# EAGLE design node (EAGLE 9.6.2)

## Sheet 1 of 2
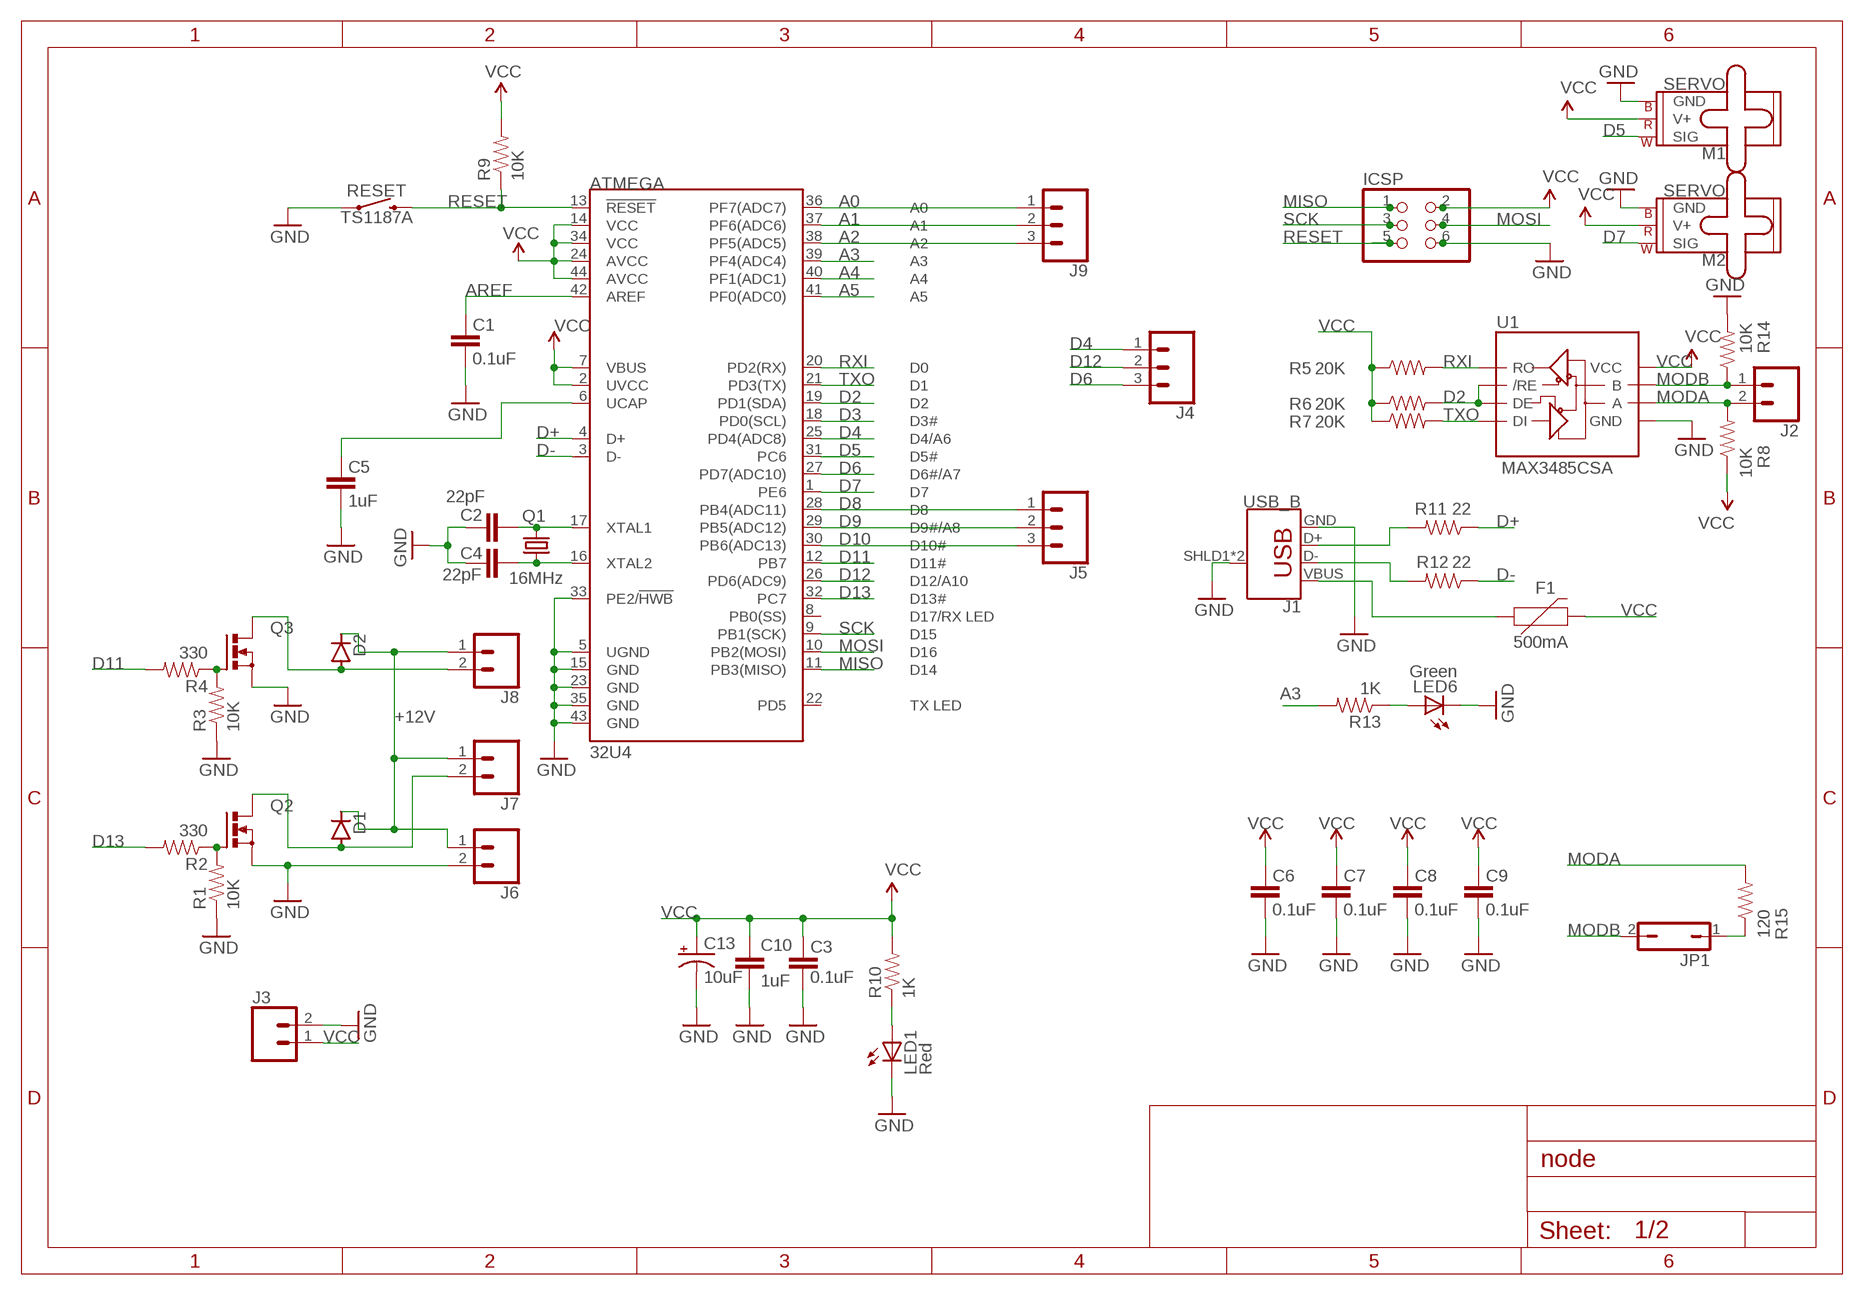
[diagram p0: schematic, sheet 1]

### Parts
ATMEGA  32U4  ATMEGA32U41:1  [QFN-44-NOPAD_1:1]
C1  0.1uF  CAP0603-CAP  [0603-CAP]
C2  22pF  CAP0603-CAP  [0603-CAP]
C3  0.1uF  CAP0603-CAP  [0603-CAP]
C4  22pF  CAP0603-CAP  [0603-CAP]
C5  1uF  CAP0603-CAP  [0603-CAP]
C6  0.1uF  CAP0603-CAP  [0603-CAP]
C7  0.1uF  CAP0603-CAP  [0603-CAP]
C8  0.1uF  CAP0603-CAP  [0603-CAP]
C9  0.1uF  CAP0603-CAP  [0603-CAP]
C10  1uF  CAP0603-CAP  [0603-CAP]
C13  10uF  CAP_POL1206  [EIA3216]
D1  BYS10  [SOD106A]
D2  BYS10  [SOD106A]
F1  500mA  PPTC_HALF-AMP  [1206]
ICSP  PINHD-2X3  [2X03]
J1  USB_B  USB_B_PTH  [USB-B-PTH]
J2  CONN_025MM  [SCREWTERMINAL-5MM-2]
J3  CONN_025MM  [SCREWTERMINAL-5MM-2]
J4  CONN_03-SCREW-5MM  [SCREWTERMINAL-5MM-3]
J5  CONN_03-SCREW-5MM  [SCREWTERMINAL-5MM-3]
J6  CONN_025MM  [SCREWTERMINAL-5MM-2]
J7  CONN_025MM  [SCREWTERMINAL-5MM-2]
J8  CONN_025MM  [SCREWTERMINAL-5MM-2]
J9  CONN_03-SCREW-5MM  [SCREWTERMINAL-5MM-3]
JP1  JP1Q  [JP1]
LED1  Red  LED0603  [LED-0603]
LED6  Green  LED0603  [LED-0603]
M1  SERVO  [1X03]
M2  SERVO  [1X03]
Q1  16MHz  KX-7  [3.2X2.5_KX-7]
Q2  PMOSFET_NTO220BV  [TO220BV]
Q3  PMOSFET_NTO220BV  [TO220BV]
R1  10K  RESISTOR0603-RES  [0603-RES]
R2  330  RESISTOR0603-RES  [0603-RES]
R3  10K  RESISTOR0603-RES  [0603-RES]
R4  330  RESISTOR0603-RES  [0603-RES]
R5  20K  RESISTOR0603-RES  [0603-RES]
R6  20K  RESISTOR0603-RES  [0603-RES]
R7  20K  RESISTOR0603-RES  [0603-RES]
R8  10K  RESISTOR0603-RES  [0603-RES]
R9  10K  RESISTOR0603-RES  [0603-RES]
R10  1K  RESISTOR0603-RES  [0603-RES]
R11  22  RESISTOR0603-RES  [0603-RES]
R12  22  RESISTOR0603-RES  [0603-RES]
R13  1K  RESISTOR0603-RES  [0603-RES]
R14  10K  RESISTOR0603-RES  [0603-RES]
R15  120  RESISTOR0603-RES  [0603-RES]
RESET  TS1187A  MOMENTARY-SWITCH-SPST-SMD-5.2MM  [TACTILE_SWITCH_SMD_5.2MM]
U1  MAX3485CSA  RS485SOIC  [SO08]

### Nets
+12V: D1.K D2.K J6.1 J7.1 J8.1
A0: ATMEGA.36(PF7(ADC7)) J9.1
A1: ATMEGA.37(PF6(ADC6)) J9.2
A2: ATMEGA.38(PF5(ADC5)) J9.3
A3: ATMEGA.39(PF4(ADC4)) R13.2
A4: ATMEGA.40(PF1(ADC1))
A5: ATMEGA.41(PF0(ADC0))
AREF: ATMEGA.42(AREF) C1.2
D2: ATMEGA.19(PD1(SDA)) R6.2 U1.2(/RE) U1.3(DE)
D3: ATMEGA.18(PD0(SCL))
D4: ATMEGA.25(PD4(ADC8)) J4.1
D5: ATMEGA.31(PC6) M1.1(SIG)
D6: ATMEGA.27(PD7(ADC10)) J4.3
D7: ATMEGA.1(PE6) M2.1(SIG)
D8: ATMEGA.28(PB4(ADC11)) J5.1
D9: ATMEGA.29(PB5(ADC12)) J5.2
D10: ATMEGA.30(PB6(ADC13)) J5.3
D11: ATMEGA.12(PB7) R4.2
D12: ATMEGA.26(PD6(ADC9)) J4.2
D13: ATMEGA.32(PC7) R2.2
D+: ATMEGA.4(D+) R11.1
D-: ATMEGA.3(D-) R12.1
GND [vcc]: ATMEGA.5(UGND) ATMEGA.15(GND) ATMEGA.23(GND) ATMEGA.33(PE2/!HWB) ATMEGA.35(GND) ATMEGA.43(GND) C1.1 C2.2 C3.1 C4.2 C5.1 C6.1 C7.1 C8.1 C9.1 C10.2 C13.C(-) ICSP.6 J1.GND J1.SHLD1(SHIELD) J1.SHLD2(SHIELD) J3.2 J6.2 LED1.C LED6.C M1.3(GND) M2.3(GND) Q2.S Q3.S R1.1 R3.1 R14.2 RESET.1 U1.5(GND)
MISO: ATMEGA.11(PB3(MISO)) ICSP.1
MODA: J2.2 R8.2 R15.2 U1.6(A)
MODB: J2.1 JP1.2 R14.1 U1.7(B)
MOSI: ATMEGA.10(PB2(MOSI)) ICSP.4
N$1: ATMEGA.16(XTAL2) C4.1 Q1.1
N$2: ATMEGA.17(XTAL1) C2.1 Q1.3
N$3: JP1.1 R15.1
N$4: ATMEGA.6(UCAP) C5.2
N$6: J1.D- R12.2
N$7: Q2.G R1.2 R2.1
N$8: J1.D+ R11.2
N$11: D1.A J7.2 Q2.D
N$13: Q3.G R3.2 R4.1
N$16: D2.A J8.2 Q3.D
N$21: LED6.A R13.1
N$26: F1.1 J1.VBUS
N$38: LED1.A R10.1
RESET: ATMEGA.13(!RESET) ICSP.5 R9.1 RESET.3
RXI: ATMEGA.20(PD2(RX)) R5.2 U1.1(RO)
SCK: ATMEGA.9(PB1(SCK)) ICSP.3
TXO: ATMEGA.21(PD3(TX)) R7.2 U1.4(DI)
VCC: ATMEGA.2(UVCC) ATMEGA.7(VBUS) ATMEGA.14(VCC) ATMEGA.24(AVCC) ATMEGA.34(VCC) ATMEGA.44(AVCC) C3.2 C6.2 C7.2 C8.2 C9.2 C10.1 C13.A(+) F1.2 ICSP.2 J3.1 M1.2(V+) M2.2(V+) R5.1 R6.1 R7.1 R8.1 R9.2 R10.2 U1.8(VCC) ; supply symbol labelled UVCC
Unconnected: ATMEGA.8(PB0(SS)) ATMEGA.22(PD5)

## Sheet 2 of 2
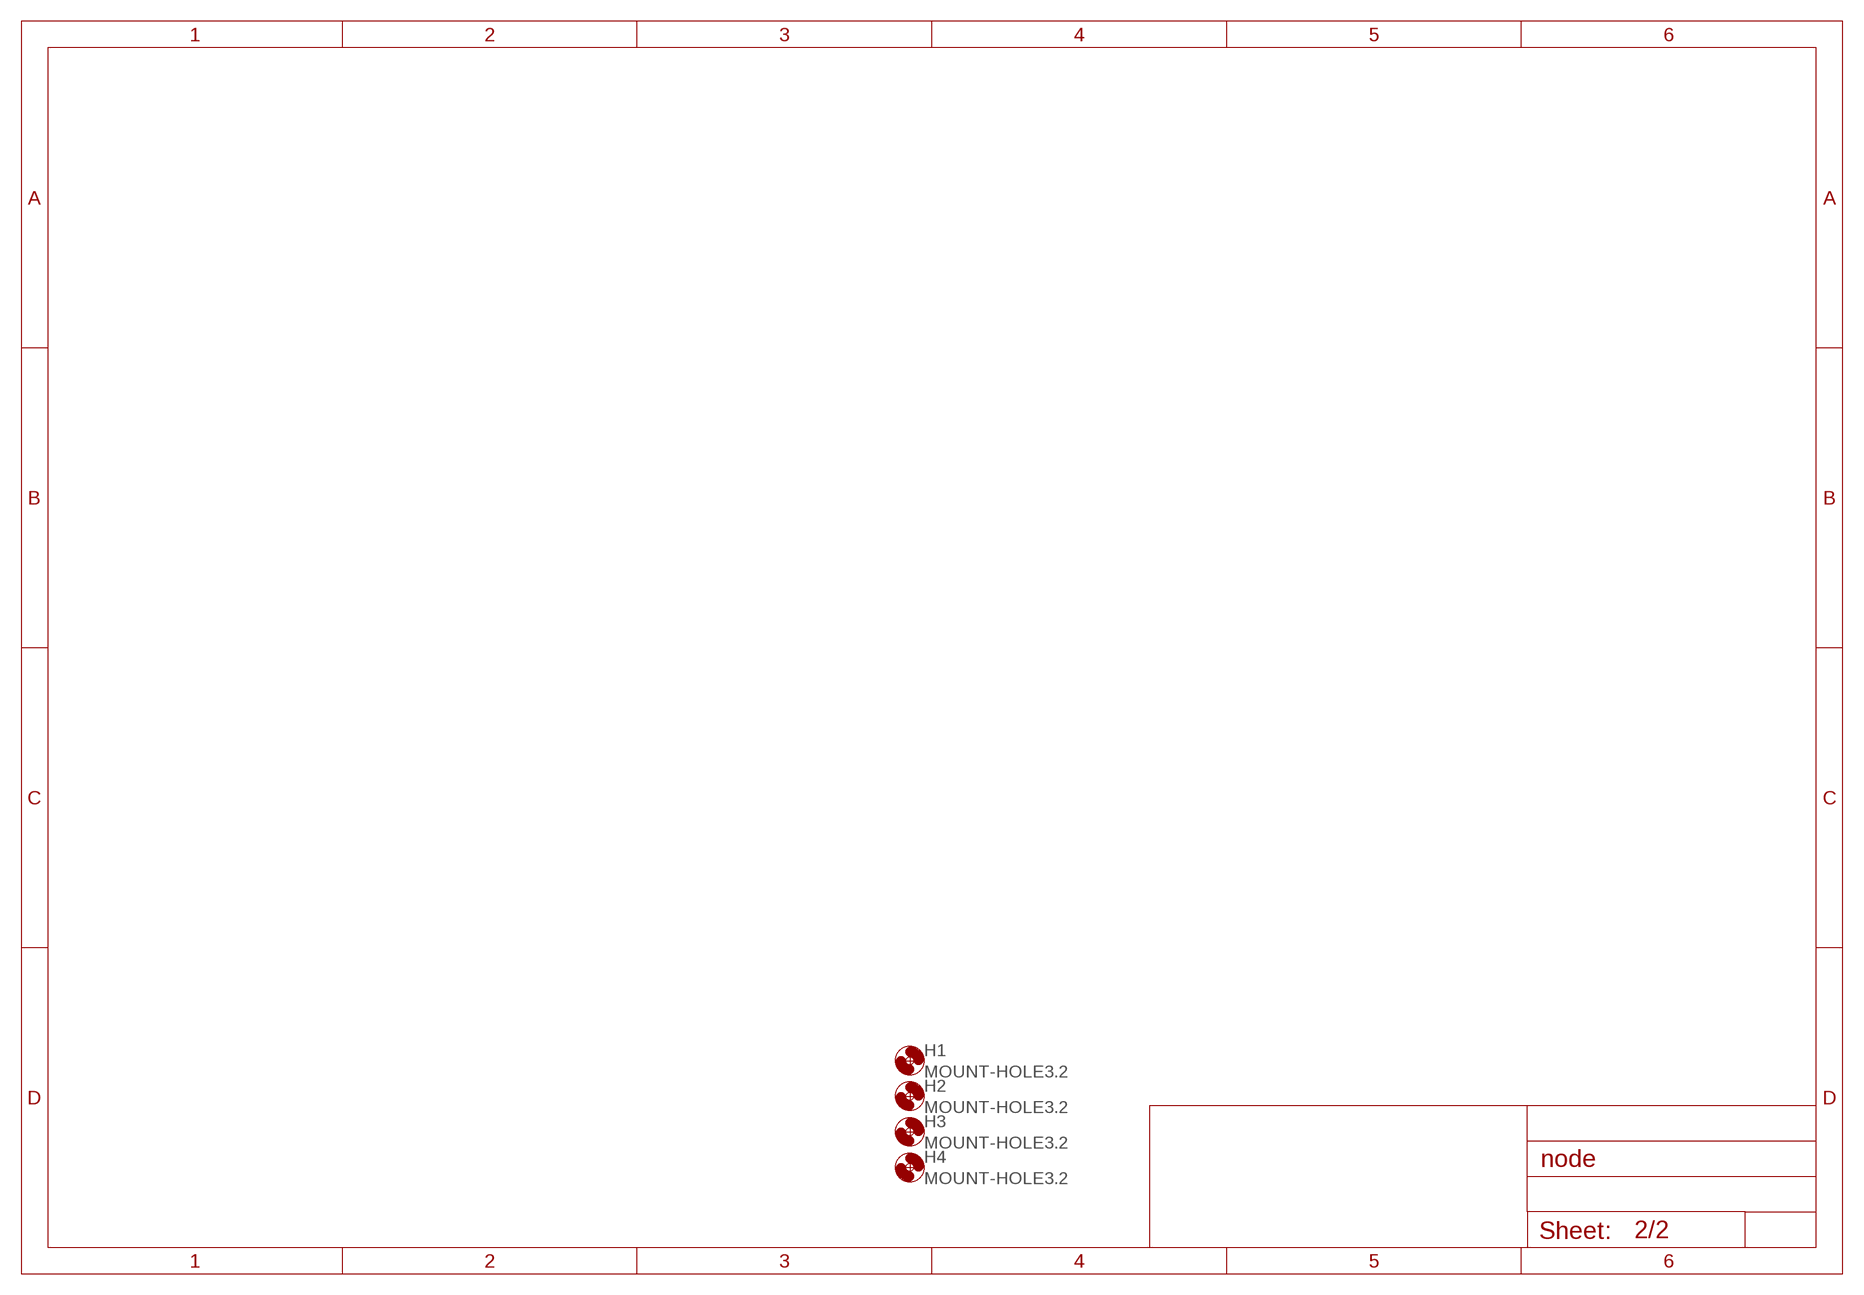
[diagram p1: schematic, sheet 2]

### Parts
H1  MOUNT-HOLE3.2  [3,2]
H2  MOUNT-HOLE3.2  [3,2]
H3  MOUNT-HOLE3.2  [3,2]
H4  MOUNT-HOLE3.2  [3,2]

## Library data of the parts
ATMEGA = SparkFun-IC-Microcontroller:ATMEGA32U4: Atmel MCU, 32KByte Atmel 44-pin 8-bit Microcontroller with 32KBytes of ISP Flash and USB Controller Datasheet <http://cdn.sparkfun.com/datasheets/Dev/Arduino/Boards/ATMega32U4.pdf> SparkFun Products LilyPad Arduino USB - ATmega32U4 Board <https://www.sparkfun.com/products/12049> (DEV-12049) Pro Micro - 5V/16MHz <https://www.sparkfun.com/products/12640> (DEV-12640) Pro Micro - 3.3V/8MHz <https://www.sparkfun.com/products/12587> (DEV-12587) Fio v3 - ATmega32U4 <https://www.sparkfun.com/products/11520> (DEV-11520) Qduino Mini <https://www.sparkfun.com/products/13614> (DEV-13614) Makey Makey - Standard Kit <https://www.sparkfun.com/products/11511> (WIG-11511) Makey Makey Deluxe Kit <https://www.sparkfun.com/products/11519> (WIG-11519); PROD_ID: IC-10828
C1-C10 = SparkFun:CAP: Capacitor Standard 0603 ceramic capacitor, and 0.1" leaded capacitor.
C13 = SparkFun:CAP_POL: Capacitor Polarized These are standard SMD and PTH capacitors. Normally 10uF, 47uF, and 100uF in electrolytic and tantalum varieties. Always verify the external diameter of the through hole cap, it varies with capacity, voltage, and manufacturer. The EIA devices should be standard.
D1 D2 = telefunken:BYS10: DIODE; MPN: BYS10/45; OC_FARNELL: 9549188; OC_NEWARK: 96K7236
F1 = SparkFun-Fuses:PPTC: Resettable Fuse PPTC Resettable Fuse. Really a sort of resistor with a polymeric positive temperature coefficient whose resistance increases dramatically with an increase in temperature. When heated by the power passing through the resistance rises causing the current to be limited, protecting the circuit. This is achieved by the transition of the polymer from a crystalline to an amorphous state where the conductive carbon separates breaking the conductive pathways found in the cool crystalline structure. When a PPTC cools back down it resumes conducting letting the circuit turn back on. SparkFun Products: SparkFun RedBoard - Programmed with Arduino <https://www.sparkfun.com/products/12757> Pro Micro - 5V/16MHz <https://www.sparkfun.com/products/12640> Arduino Pro 328 - 5V/16MHz <https://www.sparkfun.com/products/10915> MP3 Trigger <https://www.sparkfun.com/products/13720>; PROD_ID: RES-08585; VALUE: 6V/0.5A
H1-H4 = holes:MOUNT-HOLE: MOUNTING HOLE with drill center marker
ICSP = pinhead:PINHD-2X3: PIN HEADER
J1 = SparkFun-Connectors:USB_B: USB Type B Connector SparkFun Products: SparkFun Stepoko <https://www.sparkfun.com/products/13899> PTH; PROD_ID: CONN-08278; SF_ID: PRT-00139
J2 J3 J6-J8 = SparkFun-Connectors:CONN_02: Multi connection point. Often used as Generic Header-pin footprint for 0.1 inch spaced/style header connections On any of the 0.1 inch spaced packages, you can populate with these: Break Away Headers - Straight <https://www.sparkfun.com/products/116> (PRT-00116) Break Away Male Headers - Right Angle <https://www.sparkfun.com/products/553> (PRT-00553) Female Headers <https://www.sparkfun.com/products/115> (PRT-00115) Break Away Headers - Machine Pin <https://www.sparkfun.com/products/117> (PRT-00117) Break Away Female Headers - Swiss Machine Pin <https://www.sparkfun.com/products/743> (PRT-00743) For SCREWTERMINALS and SPRING TERMINALS visit here: Screw Terimnals on SparkFun.com <https://www.sparkfun.com/search/results?term=Screw+Terminals> (5mm/3.5mm/2.54mm spacing) This device is also useful as a general connection point to wire up your design to another part of your project. Our various solder wires solder well into these plated through hole pads. Hook-Up Wire - Assortment (Stranded, 22 AWG) <https://www.sparkfun.com/products/11375> (PRT-11375) Hook-Up Wire - Assortment (Solid Core, 22 AWG) <https://www.sparkfun.com/products/11367> (PRT-11367) View the entire wire category on our website here <https://www.sparkfun.com/categories/141> Special notes: Molex polarized connector foot print use with: PRT-08233 with associated crimp pins and housings. 2.54_SCREWTERM for use with PRT-10571. 3.5mm Screw Terminal footprints for PRT-08084 5mm Screw Terminal footprints for use with PRT-08432; SF_SKU: PRT-08432
J4 J5 J9 = SparkFun-Connectors:CONN_03: Multi connection point. Often used as Generic Header-pin footprint for 0.1 inch spaced/style header connections On any of the 0.1 inch spaced packages, you can populate with these: Break Away Headers - Straight <https://www.sparkfun.com/products/116> (PRT-00116) Break Away Male Headers - Right Angle <https://www.sparkfun.com/products/553> (PRT-00553) Female Headers <https://www.sparkfun.com/products/115> (PRT-00115) Break Away Headers - Machine Pin <https://www.sparkfun.com/products/117> (PRT-00117) Break Away Female Headers - Swiss Machine Pin <https://www.sparkfun.com/products/743> (PRT-00743) Stackable Header - 3 Pin (Female, 0.1") <https://www.sparkfun.com/products/13875> (PRT-13875) For SCREWTERMINALS and SPRING TERMINALS visit here: Screw Terimnals on SparkFun.com <https://www.sparkfun.com/search/results?term=Screw+Terminals> (5mm/3.5mm/2.54mm spacing) This device is also useful as a general connection point to wire up your design to another part of your project. Our various solder wires solder well into these plated through hole pads. Hook-Up Wire - Assortment (Stranded, 22 AWG) <https://www.sparkfun.com/products/11375> (PRT-11375) Hook-Up Wire - Assortment (Solid Core, 22 AWG) <https://www.sparkfun.com/products/11367> (PRT-11367) View the entire wire category on our website here <https://www.sparkfun.com/categories/141> Special notes: Molex polarized connector foot print use with SKU : PRT-08232 with associated crimp pins and housings.; PROD_ID: CONN-10134; SF_SKU: PRT-08433
JP1 = jumper:JP1Q: JUMPER
LED1 LED6 = SparkFun:LED: LEDs Standard schematic elements and footprints for 5mm, 3mm, 1206, and 0603 sized LEDs. 5mm - Spark Fun Electronics SKU : COM-00529 (and others)
M1 M2 = SparkFun-Electromechanical:SERVO: Servo Motor 3-pin connector for a standard servo motor (voltage supply, ground, and control signal.) SparkFun Products Servo - Generic (Sub-Micro Size) <https://www.sparkfun.com/products/9065> (ROB-09065) Servo - Generic High Torque Continuous Rotation (Standard Size) <https://www.sparkfun.com/products/9347> (ROB-09347) Servo - Generic High Torque (Standard Size) <https://www.sparkfun.com/products/11965> (ROB-11965)
Q1 = crystal-geyer_V1_0:KX: Quartz Crystals (MHz) SMD: KX - Serie Model Size l/w/h [mm] Frequency Range Frequency Stability Temp. Range [°C] Load Capacitance AECQ 200 availabel Datasheet KX-4 KX-5 KX-6 KX-7 KX-9A KX-9B KX-12A KX-12B KX-13 KX-20 KX-K KX-KS 1.6/1.2/0.3 2.0/1.6/0.45 2.5/2.0/0.55 3.2/2.5/0.8 5.0/3.2/1.0 5.0/3.2/1.1 6.0/3.5/1.1 6.0/3.5/1.0 7.0/5.0 /1.3 11.6/5.5/1.6 12.3/4.5/4.2 12.3/4.5/3.2 24.0 ~ 80.0 MHz 16.0 ~ 80.0 MHz 12.0 ~ 80.0 MHz 8.0 ~ 60.0 MHz 7,68 ~ 300,0 MHz 8,0 ~ 50,0 MHz 8,0 ~ 150,0 MHz 8,0 ~ 50,0 MHz 6,0 ~ 160,0 MHz 3,579 ~ 25,0 MHz 3,579 ~ 70,0 MHz 3,579 ~ 70,0 MHz ±10 … ±50ppm ±10 … ±50ppm ±10 … ±50ppm ±10 … ±50ppm ±10 … ±50ppm ±10 … ±50ppm ±10 … ±50ppm ±10 … ±50ppm ±10 … ±50ppm ±50ppm ±10 … ±50ppm ±10 … ±50ppm (*) -40°C …+85°C (*) -40°C …+125°C (*) -40°C …+125°C (*) -40°C …+125°C (*) -40°C …+105°C (*) -40°C …+105°C (*) -40°C …+125°C (*) -40°C …+105°C (*) -40°C …+105°C (*) -40°C …+105°C (*) -40°C …+85°C (*) -40°C …+85°C 8, 8…16 8, 8…16 10, 8…16 12, 7…20 16, 10…20 16, 10…20 16, 10…20 16, 12…20 16, 12…20 16, 12…20 16, 12…30 16, 12…30 - yes yes yes - - - - - - - - KX-4.pdf <http://www.geyer-electronic.de/uploads/tx_userartikelfrequenz/GEYER-KX-4.pdf> KX-5.pdf <http://www.geyer-electronic.de/uploads/tx_userartikelfrequenz/GEYER-KX-5.pdf> KX-6.pdf <http://www.geyer-electronic.de/uploads/tx_userartikelfrequenz/GEYER-KX-6.pdf> KX-7.pdf <http://www.geyer-electronic.de/uploads/tx_userartikelfrequenz/GEYER-KX-7.pdf> KX-9A.pdf <http://www.geyer-electronic.de/uploads/tx_userartikelfrequenz/GEYER-KX-9A.pdf> KX-9B.pdf <http://www.geyer-electronic.de/uploads/tx_userartikelfrequenz/GEYER-KX-9B.pdf> KX-12A.pdf <http://www.geyer-electronic.de/uploads/tx_userartikelfrequenz/GEYER-KX-12A.pdf> KX-12B.pdf <http://www.geyer-electronic.de/uploads/tx_userartikelfrequenz/GEYER-KX-12B.pdf> KX-13.pdf <http://www.geyer-electronic.de/uploads/tx_userartikelfrequenz/GEYER-KX-13.pdf> KX-20.pdf <http://www.geyer-electronic.de/uploads/tx_userartikelfrequenz/GEYER-KX-20.pdf> KX-K.pdf <http://www.geyer-electronic.de/uploads/tx_userartikelfrequenz/GEYER-KX-K.pdf> KX-KS.pdf <http://www.geyer-electronic.de/uploads/tx_userartikelfrequenz/GEYER-KX-KS.pdf> <http://www.geyer-electronic.de/fileadmin/template/img/logo-geyer-electronic.png> Details see: http://www.geyer-electronic.de/Frequenz-Produkte.9.0.html Created 2016-06-07, Hans Locher 2016 (C) Geyer Quartz Technology KX4,KX5,KX6,KX7,KX9A,KX9B,KX12A,KX12B,KX13,KX20,KXK,KXKS;1612;2016;2520;3225;5032;6035;7050;11655;12345;1,6x1,2;2,0x1,6;2,5x2,0;3,2x2,5;5,0x3,2;6,0x3,5;7,0x5,0;11,6x5,5;12,3x4,5;12,3x4,5;1.6x1.2;2.0x1.6;2.5x2.0;3.2x2.5;5.0x3.2;6.0x3.5;7.0x5.0;11.6x5.5;12.3x4.5;12.3x4.5;
Q2 Q3 = transistor-power:PMOSFET_N: Power MOSFET N-Channel
R1-R15 = SparkFun:RESISTOR: Resistor Basic schematic elements and footprints for 0603, 1206, and PTH resistors.
RESET = SparkFun-Switches:MOMENTARY-SWITCH-SPST: Momentary Switch (Pushbutton) - SPST Normally-open (NO) SPST momentary switches (buttons, pushbuttons). Variants PTH-12MM - 12mm square, through-hole Momentary Pushbutton Switch - 12mm Square <https://www.sparkfun.com/products/9190> (COM-09190) PTH-6.0MM, PTH-6.0MM-KIT - 6.0mm square, through-hole Mini Pushbutton Switch <https://www.sparkfun.com/products/97> (COM-00097) KIT package intended for soldering kit's - only one side of pads' copper is exposed. PTH-RIGHT-ANGLE-KIT - Right-angle, through-hole Right Angle Tactile Button <https://www.sparkfun.com/products/10791> - Used on SparkFun BigTime Watch Kit <https://www.sparkfun.com/products/11734> SMD-12MM - 12mm square, surface-mount Tactile Button - SMD (12mm) <https://www.sparkfun.com/products/12993> (COM-12993) Used on SparkFun PicoBoard <https://www.sparkfun.com/products/11888> SMD-4.5MM - 4.5mm Square Trackball Switch Used on SparkFun Blackberry Trackballer Breakout <https://www.sparkfun.com/products/13169> SMD-4.6MMX2.8MM - 4.60mm x 2.80mm, surface mount Used on SparkFun SAMD21 Mini Breakout <https://www.sparkfun.com/products/13664> SMD-5.2MM, SMD-5.2-REDUNDANT - 5.2mm square, surface-mount Mini Pushbutton Switch - SMD <https://www.sparkfun.com/products/8720> (COM-08720) Used on Arduino Pro Mini <https://www.sparkfun.com/products/11114> REDUNDANT package connects both switch circuits together SMD-6.0X3.5MM - 6.0 x 3.5mm, surface mount Momentary Reset Switch SMD <https://www.sparkfun.com/products/8229> (COM-08229) SMD-6.2MM-TALL - 6.2mm square, surface mount Tactile Button - SMD (6mm) <https://www.sparkfun.com/products/12992> Used on SparkFun Digital Sandbox <https://www.sparkfun.com/products/12651> SMD-RIGHT-ANGLE - Right-angle, surface mount Used on SparkFun Block for Intel® Edison - Arduino <https://www.sparkfun.com/products/13036>; PROD_ID: SWCH-08247; SF_SKU: COM-08720
U1 = SparkFun-IC-Comms:RS485: RS-485 Transceiver SP3485 Series 8 Pin NSOIC 3.3 V Low Power Half Duplex RS-485 Transceiver MAX3485 compatible Datasheet <http://www.sparkfun.com/datasheets/Components/General/sp3485CN-LTR.pdf> SparkFun Products SparkFun Transceiver Breakout - RS-485 <https://www.sparkfun.com/products/10124> (BOB-10124) SparkFun USB to RS-485 Converter <https://www.sparkfun.com/products/9822> (BOB-09822); PROD_ID: IC-09388

## Net classes
0 default: width 0.203 mm

## Board
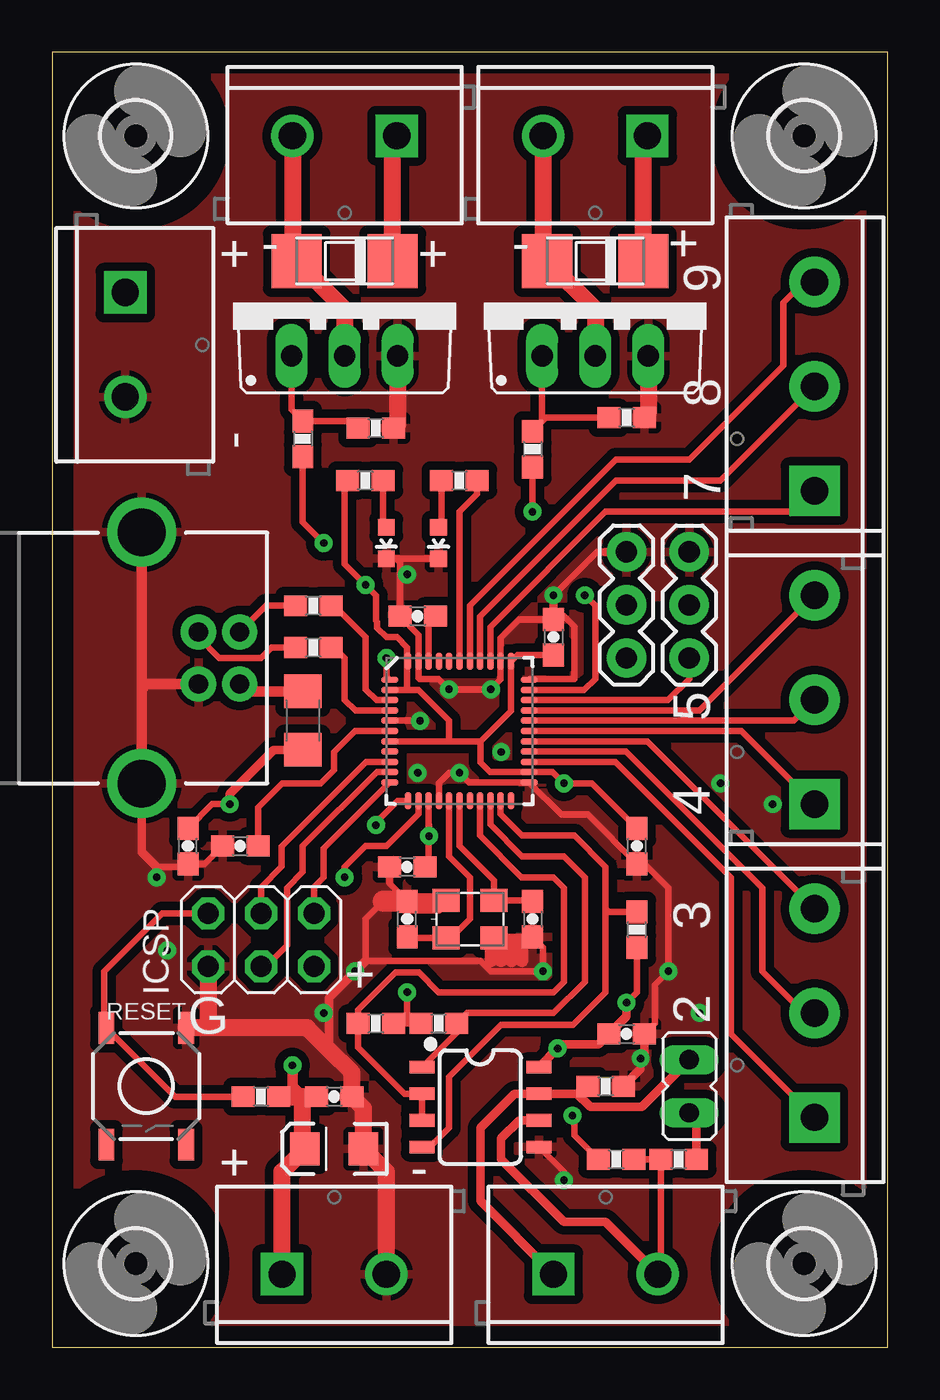
[diagram p2: board, top side]
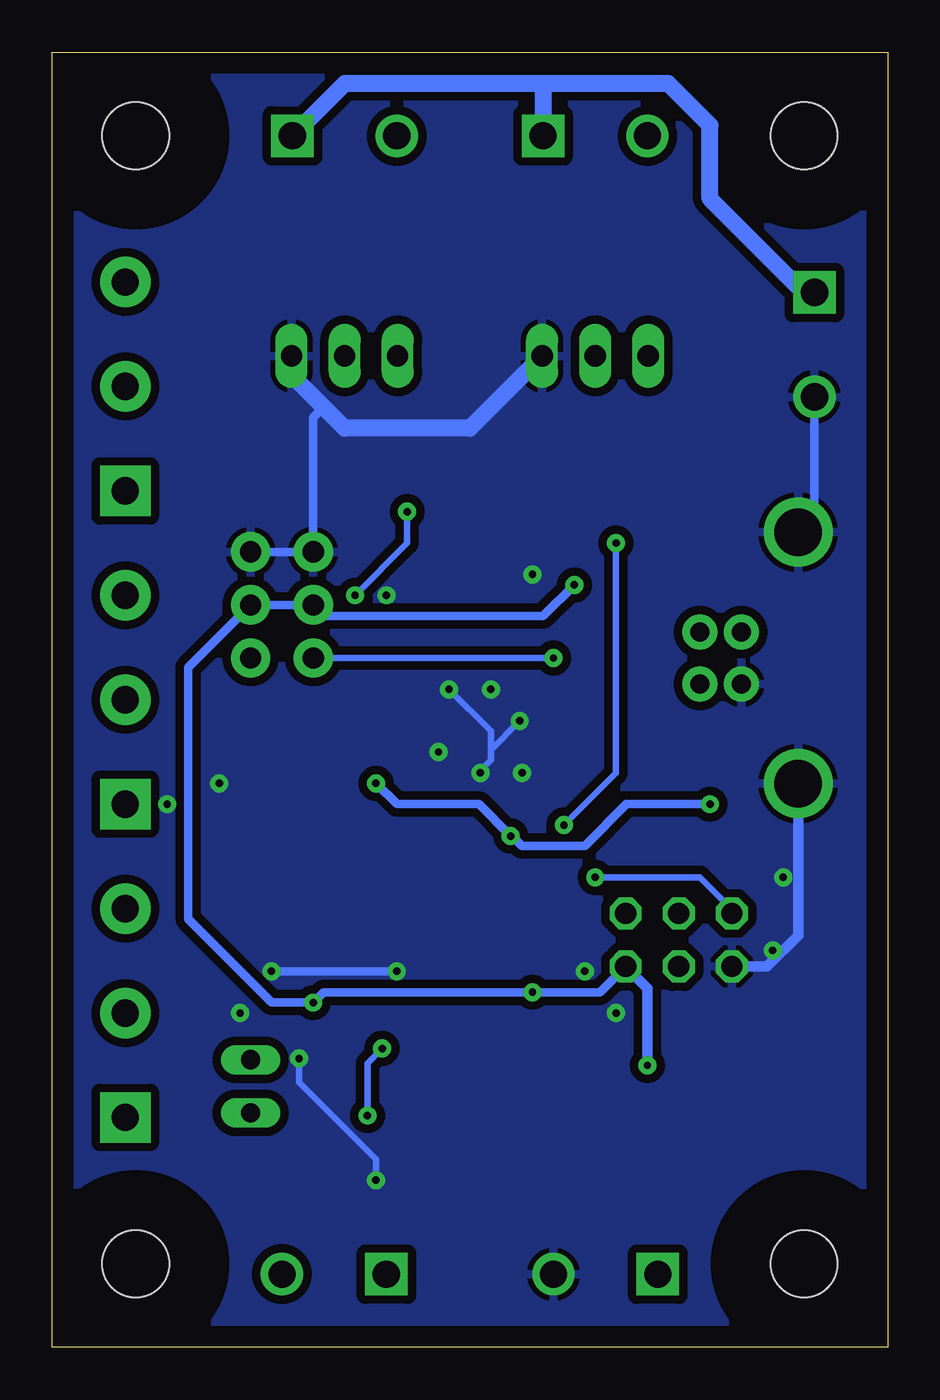
[diagram p3: board, bottom side, seen from below]

Size 40 x 62 mm. Coordinates in mm from the lower left corner, seen from the top.
Outline: 0,0 40,0 40,62 0,62 0,0
Copper layers (1*16): Top 0.035mm / dielectric 1.5mm / Bottom 0.035mm
Design rules "default *": minimum track width 12mil, minimum drill 0.35mm, track to track 6mil, track to pad 6mil, pad to pad 6mil, via to via 6mil, smd to smd 6mil, copper to edge 40mil, drill to drill 12mil, minimum pad ring 10mil, minimum via ring 10mil, stop-mask expansion 4mil, vias tented up to drill 100mil, thermal gap 10mil

### Footprints (pad centres in the part's own frame; a part is rotated, then mirrored left to right if it is on the bottom)
QFN-44-NOPAD_1:1 = smd 0.8 x 0.3: 1 -3.337,2.458; 2 -3.337,1.958; 3 -3.337,1.479; 4 -3.337,0.979; 5 -3.337,0.5; 6 -3.337,0; 7 -3.337,-0.5; 8 -3.337,-0.979; 9 -3.337,-1.479; 10 -3.337,-1.958; 11 -3.337,-2.458; 23 3.337,-2.458; 24 3.337,-1.958; 25 3.337,-1.479; 26 3.337,-0.979; 27 3.337,-0.5; 28 3.337,0; 29 3.337,0.5; 30 3.337,0.979; 31 3.337,1.479; 32 3.337,1.958; 33 3.337,2.458 | smd 0.3 x 0.8: 12 -2.458,-3.337; 13 -1.958,-3.337; 14 -1.479,-3.337; 15 -0.979,-3.337; 16 -0.5,-3.337; 17 0,-3.337; 18 0.5,-3.337; 19 0.979,-3.337; 20 1.479,-3.337; 21 1.958,-3.337; 22 2.458,-3.337; 34 2.458,3.337; 35 1.958,3.337; 36 1.479,3.337; 37 0.979,3.337; 38 0.5,3.337; 39 0,3.337; 40 -0.5,3.337; 41 -0.979,3.337; 42 -1.479,3.337; 43 -1.958,3.337; 44 -2.458,3.337
0603-CAP = smd 1.1 x 1: 1 -0.85,0; 2 0.85,0
EIA3216 = smd 1.4 x 1.6: A 1.4,0; C -1.4,0
SOD106A = smd 2.4 x 2.6: A 2.3,0; K -2.3,0
1206 = smd 1.6 x 1.8: 1 -1.4,0; 2 1.4,0
3,2 = hole 3.2: 0,0
2X03 = drill 1.016 octagon: 1 -2.54,-1.27; 2 -2.54,1.27; 3 0,-1.27; 4 0,1.27; 5 2.54,-1.27; 6 2.54,1.27
USB-B-PTH = drill 0.914 pad 1.676: D+ 4,1.25; D- 5.981,1.25; GND 4,-1.25; VBUS 5.981,-1.25 | drill 2.286: SHLD1 1.282,-6.02; SHLD2 1.282,6.02
SCREWTERMINAL-5MM-2 = drill 1.3 pad 2.032 square: 1 0,0 | drill 1.3 pad 2.032: 2 5,0
SCREWTERMINAL-5MM-3 = drill 1.3 pad 2.413 square: 1 0,0 | drill 1.3 pad 2.413: 2 5,0; 3 10,0
JP1 = drill 0.914 long: 1 0,-1.27; 2 0,1.27
LED-0603 = smd 0.8 x 0.8: A 0,-0.75; C 0,0.75
1X03 = drill 1.016 pad 1.88: 1 0,0; 2 2.54,0; 3 5.08,0
3.2X2.5_KX-7 = smd 1.3 x 1.1: 1 -1.15,-0.9; 2 1.15,-0.9; 3 1.15,0.9; 4 -1.15,0.9
TO220BV = drill 1.016 long: D 0,-2.54; G -2.54,-2.54; S 2.54,-2.54
0603-RES = smd 1.1 x 1: 1 -0.85,0; 2 0.85,0
TACTILE_SWITCH_SMD_5.2MM = smd 1.524 x 0.762: 1 -2.794,1.905; 2 2.794,1.905; 3 -2.794,-1.905; 4 2.794,-1.905
SO08 = smd 0.6 x 1.2: 1 -1.905,-2.8; 2 -0.635,-2.8; 3 0.635,-2.8; 4 1.905,-2.8; 5 1.905,2.8; 6 0.635,2.8; 7 -0.635,2.8; 8 -1.905,2.8

### Placement (x,y rotation side)
ATMEGA  19.5,29.5 0 top
C1  17.5,35 0 top
C2  23,20.5 270 top
C3  13.5,12 180 top
C4  17,20.5 90 top
C5  9,24 0 top
C6  28,24 90 top
C7  24,34 270 top
C8  6.5,24 90 top
C9  17,23 0 top
C10  27.5,15 0 top
C13  13.5,9.5 180 top
D1  26,52 180 top
D2  14,52 180 top
F1  12,30 270 top
H1  4,4 0 top
H2  36,58 0 top
H3  36,4 0 top
H4  4,58 0 top
ICSP  10,19.5 180 top
J1  3,33 0 top
J2  24,3.5 0 top
J3  11,3.5 0 top
J4  36.5,11 90 top
J5  36.5,26 90 top
J6  3.5,50.5 270 top
J7  28.5,58 180 top
J8  16.5,58 180 top
J9  36.5,41 90 top
JP1  30.5,12.5 0 top
LED1  16,38.5 180 top
LED6  18.5,38.5 180 top
M1  30.5,33 90 top
M2  27.5,33 90 top
Q1  20,20.5 0 top
Q2  26,50 0 top
Q3  14,50 0 top
R1  27.5,44.5 180 top
R2  23,43 270 top
R3  15.5,44 180 top
R4  12,43.5 270 top
R5  18.5,15.5 0 top
R6  15.5,15.5 180 top
R7  28,20 90 top
R8  27,9 0 top
R9  10,12 0 top
R10  15,41.5 180 top
R11  12.5,33.5 180 top
R12  12.5,35.5 180 top
R13  19.5,41.5 0 top
R14  26.5,12.5 0 top
R15  30,9 180 top
RESET  4.5,12.5 270 top
U1  20.5,11.5 270 top

### Tracks (layer width: path | path; a pad name or v marks a point on that pad's centre or on a via)
+12V
  Top 0.813: D2.K 16.3,57.8 J8.1 | D1.K 28.3,57.8 J7.1
  Bottom 0.813: J6.1 4,50.5 8.5,55 8.5,58.5 10.5,60.5 16.5,60.5 | 16.5,60.5 26,60.5 J7.1 | 16.5,60.5 J8.1
A0
  Top 0.305: ATMEGA.36 20.98,34.48 26.5,40 35.5,40 J9.1
A1
  Top 0.305: ATMEGA.37 20.48,34.98 27,41.5 32,41.5 J9.2
A2
  Top 0.305: ATMEGA.38 20,35.5 27,42.5 30.5,42.5 35,47 35,50 36,51 J9.3
A3
  Top 0.305: ATMEGA.39 19.5,40 20.35,40.85 R13.2
AREF
  Top 0.305: ATMEGA.42 18.02,34.67 C1.2
D2
  Top 0.305: ATMEGA.19 20.48,24.5 22.48,22.5 24,22.5 24.5,22 24.5,17.5 24,17 18.5,17 17.56,17.94 16.44,17.94 14.65,16.15 R6.2 14.65,14.35 16.86,12.13 U1.2 U1.3
D4
  Top 0.305: J4.1 32.5,15 32.5,22.5 26.98,28.02 ATMEGA.25
D5
  Top 0.305: M1.1 30.5,32 29.48,30.98 ATMEGA.31
D6
  Top 0.305: ATMEGA.27 23.41,29 28.5,29 J4.3
D7  (via drill 0.35)
  Top 0.305: ATMEGA.1 16,32.12 v16,33
  Bottom 0.305: v16,33 M2.1
D8
  Top 0.305: ATMEGA.28 33,29.5 J5.1
D9
  Top 0.305: ATMEGA.29 35.5,30 J5.2
D10
  Top 0.305: ATMEGA.30 30.98,30.48 J5.3
D11  (via drill 0.35)
  Top 0.305: ATMEGA.12 16.54,26.16 15.5,25.12 v15.5,25 | v13,38.5 12,39.5 R4.2
  Bottom 0.305: v15.5,25 13,27.5 v13,38.5
D12
  Top 0.305: ATMEGA.26 26.48,28.52 27.48,28.52 34,22 34,18 36,16 J4.2
D13  (via drill 0.35)
  Top 0.305: ATMEGA.32 25.46,31.46 26,32 26,35.5 v25.5,36 | v23,40 R2.2
  Bottom 0.305: v25.5,36 23,38.5 v23,40
D+
  Top 0.305: ATMEGA.4 14.52,30.48 14,31 14,33 13.5,33.5 R11.1
D-
  Top 0.305: ATMEGA.3 15.52,30.98 15,31.5 15,34 13.5,35.5 R12.1
GND  (via drill 0.35)
  Top 0.305: C9.1 16.15,22.2 C4.2 | v17.61,29.99 17.61,30 ATMEGA.5 | ATMEGA.15 18.52,27.02 19,27.5 v19.5,27.5 19.96,27.04 ATMEGA.23 24.38,25.5 25.65,25.5 C6.1 28.35,23.15 29.5,22 v29.5,18 28.85,17.35 28.85,15.5 C10.2 | 15.85,21.35 15,20.5 15,18.5 20.5,18.5 21,18 v23.5,18 23.5,19.15 C2.2 | ATMEGA.33 22.88,32 25,32 25,34.5 24.5,35 24.15,35 C7.1 22.35,34.85 21.46,33.96 ATMEGA.35 21.46,31.96 v21,31.5 v19,31.5 18.5,32 17.59,32 17.54,32.04 ATMEGA.43 17.54,34.11 C1.1 16.65,37.6 16.5,37.75 | LED1.C 16.5,37.75 | 16.5,37.75 LED6.C | U1.5 24.5,8.39 v24.5,8 | C5.1 7.3,23.15 C8.1 6.35,23 5,23 v5,22.5 | 26.5,38.08 26.08,38.08 v24,36 | 18.5,21.5 18.5,21 | 23,19.5 22.5,19.5 22,19 21.5,19.5 21,19.5 | 21,18.5 21.5,18.5
  Top 0.406: 13.25,14.25 13.25,16.75 15,18.5 | 5,23 4.28,23.72 J1.SHLD1 | C7.1 24,35.85 | M2.3 26.5,38.08 | R14.2 28.18,13.32 v28.18,13.82 28.35,14 C10.2
  Top 0.508: J1.SHLD2 4.28,31.5 | 4.28,31.5 J1.SHLD1 | J1.GND 4.53,31.75 4.28,31.5 | 17,21.5 18.5,21.5 | 18.5,21 17,21
  Top 0.61: 21,19.5 21,18.5 | 21.5,18.5 21.5,19.5 22.5,19.5 22.5,18.5 | 22,18.5 22,19
  Top 0.813: J3.2 16,8.4 C13.C 14.9,11.45 C3.1 14.35,13.15 13.25,14.25 12.21,15.29 7.5,15.29 | 7.5,15.29 RESET.1 | ICSP.6 7.46,15.33 7.5,15.29 | Q3.S 16.54,44.19 R3.1 | Q2.S 28.54,44.69 R1.1
  Top 1.016: C4.2 15.85,21.35
  Bottom 0.305: v17.61,29.99 19,28.61 | v19.5,27.5 19.5,27.61 19,28.11 19,28.61 | v21,31.5 19,29.5 19,28.61 | v24.5,8 24.5,9 28.18,12.68 v28.18,13.82
  Bottom 0.406: v23.5,18 v29.5,18 | J1.SHLD2 3.5,39.8 J6.2 | 27,45 27.5,44.5 M2.3 M1.3
  Bottom 0.508: ICSP.6 5.77,18.23 4.28,19.72 J1.SHLD1
  Bottom 0.813: Q3.S 20,44 26,44 27,45 28.54,46.54 Q2.S
  other vias: 17,37 31,16 34.5,26 32,27 13,16 14.5,18 5.5,19 17.5,27.5 21.5,28.5
  pour Top (isolate 0.406): 0,62 0,0 40,0 40,62
  pour Bottom (isolate 0.406): 0,0 40,0 40,62 0,62
MISO
  Top 0.305: ATMEGA.11 13,23.88 13,22.5 12.54,22.04 ICSP.1
MODA
  Top 0.305: J2.2 29.15,3.65 R15.2 R8.2
  Top 0.406: U1.6 22.36,10.87 21.5,10 21.5,9 24.5,6 26.5,6 J2.2
MODB
  Top 0.406: J2.1 20.5,7 20.5,10.5 22.14,12.13 U1.7 25.14,12.13 | R14.1 25.5,12.5 25.14,12.13 | JP1.2 28.23,11.5 25.77,11.5 25.14,12.13
MOSI
  Top 0.305: ICSP.4 10.23,18.23 11.25,19.25 11.25,22 12,22.75 12,24 15.54,27.54 ATMEGA.10
N$1
  Top 0.305: ATMEGA.16 19,23.5 20,22.5 20,20.5 19.1,19.6 Q1.1 17.05,19.6 C4.1
N$2
  Top 0.305: ATMEGA.17 19.5,24 21.15,22.35 Q1.3 22.95,21.4 C2.1
N$3
  Top 0.406: JP1.1 30.85,10.88 R15.1
N$4
  Top 0.305: ATMEGA.6 14.5,29.5 13.5,28.5 13.5,27.65 12.85,27 11,27 9.85,25.85 C5.2
N$6
  Top 0.305: J1.D- 10.23,35.5 R12.2
N$7
  Top 0.305: Q2.G 23.46,44.31 R2.1 23.65,44.5 R1.2
N$8
  Top 0.305: R11.2 10.5,33.5 10,33 8,33 7,34 J1.D+
N$11
  Top 0.813: J7.2 23.5,52.2 D1.A 26,49.7 Q2.D
N$13
  Top 0.305: Q3.G 11.46,44.89 R4.1 14.3,44.35 R3.2
N$16
  Top 0.813: J8.2 11.5,52.2 D2.A 14,49.7 Q3.D
N$21
  Top 0.305: R13.1 18.65,39.4 LED6.A
N$26
  Top 0.508: F1.1 9.33,31.4 J1.VBUS
N$38
  Top 0.305: R10.1 15.85,39.4 LED1.A
RESET  (via drill 0.35)
  Top 0.305: ICSP.5 5.27,20.77 2.5,18 2.5,15.39 RESET.3 5.89,12 R9.1 | v14,22.5 14,23 15,24 16,24 17.54,25.54 ATMEGA.13
  Bottom 0.305: v14,22.5 9,22.5 7.46,20.96 ICSP.5
RXI
  Top 0.305: ATMEGA.20 20.98,25.02 22.5,23.5 24.5,23.5 25.5,22.5 25.5,17.5 24,16 19.85,16 R5.2 19.35,15.05 U1.1
SCK
  Top 0.305: ICSP.3 10,22.02 10.99,23.01 10.99,23.99 15.02,28.02 ATMEGA.9
TXO
  Top 0.305: ATMEGA.21 21.46,25.54 22.5,24.5 25,24.5 26.5,23 26.5,21 | 26.5,21 26.5,17 24.94,15.44 21.5,15.44 19,12.94 19,10.5 18.09,9.6 U1.4 | R7.2 26.65,20.85 26.5,21
VCC  (via drill 0.35)
  Top 0.305: ATMEGA.14 18.02,25.02 | 18.02,25.02 18.02,23.17 C9.2 | C7.2 22.27,33.15 ATMEGA.34 21.96,30.46 20.5,29 | 18.02,25.02 18.05,25 v18.05,24.47 | R10.2 14,41.35 14,37.5 v15,36.5 15.5,36 15.5,34.79 15.56,34.73 15.56,34.44 16,34 16.5,34 17,33.5 17,32.88 ATMEGA.44 17,32.79 17,31.5 16.96,31.46 | R8.1 25,10.15 25,11 v24.91,11.09 | R5.1 17,15.5 | 17,15.5 R6.1 | 17,15.5 v17,17 | R7.1 28,17 v27.5,16.5 | ATMEGA.7 19,29 | 19,29 20.5,29 | 19,29 19,30 17.54,31.46 16.96,31.46 | 20.5,29 20.5,28 20.96,27.54 ATMEGA.24 23.96,27.54 v24.5,27 25.85,27 C6.2 | ATMEGA.2 16.96,31.46 | v8.5,26 7.65,26 C8.2
  Top 0.406: v27.5,16.5 27.5,15.85 C10.1 26.15,14.5 24.39,14.5 v24.2,14.3 U1.8 | v8.5,26 8.5,26.5 10.6,28.6 F1.2
  Top 0.508: v11.5,13.5 11.5,12.5 12,12
  Top 0.813: R9.2 12,12 | 12,12 C3.2 | 12,12 12,9.6 C13.A 11,8.4 J3.1
  Bottom 0.305: 18.01,24.51 v18.05,24.47 | v24.91,11.09 24.91,13.59 v24.2,14.3
  Bottom 0.406: ICSP.2 13.77,17 v17,17 27,17 v27.5,16.5 29.5,16.5 33.5,20.5 33.5,32.54 M1.2 M2.2 26.96,35 16.5,35 v15,36.5 | v24.5,27 23.5,26 19.57,26 v18.05,24.47 | v24.5,27 | v8.5,26 12.5,26 14.5,24 17.5,24 18.01,24.51
  Bottom 0.508: ICSP.2 11.5,17.19 v11.5,13.5

### Text on the board
tNames: + | - | + | - | + | 9 | 8 | - | 7 | 5 | 4 | 3 | + | 2 | G | - | +